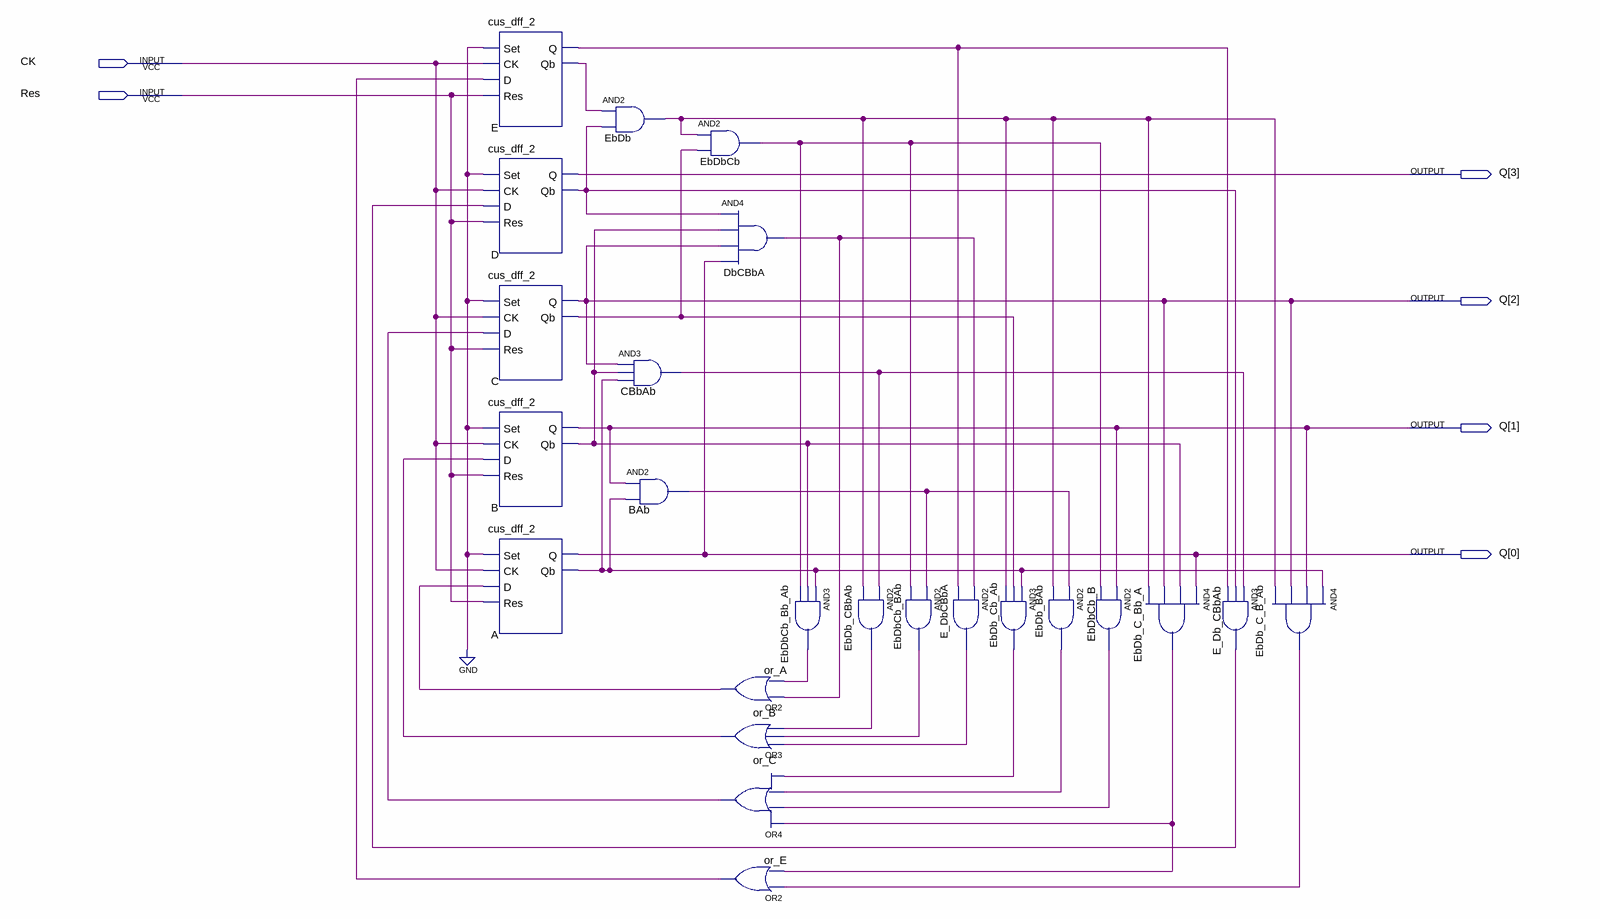
[diagram p0: schematic sheet]
// Quartus schematic number_count.bdf as structural Verilog: 24 symbols, 6 pins
module number_count (
  input  CK,
  input  Res,
  output [3:0] Q
);

  wire A_qb, B_qb, BAb_out, C_qb, CBbAb_out, D_qb, DbCBbA_out, E_Db_CBbAb_out, E_DbCBbA_out, E_q, E_qb,
       EbDb_BAb_out, EbDb_C_B_Ab_out, EbDb_C_Bb_A_out, EbDb_Cb_Ab_out, EbDb_CBbAb_out, EbDb_out,
       EbDbCb_B_out, EbDbCb_BAb_out, EbDbCb_Bb_Ab_out, EbDbCb_out, or_A_out, or_B_out, or_C_out, or_E_out;

  cus_dff_2 E (.Set(1'b0), .CK(CK), .D(or_E_out), .Res(Res), .Q(E_q), .Qb(E_qb));
  cus_dff_2 D (.Set(1'b0), .CK(CK), .D(E_Db_CBbAb_out), .Res(Res), .Q(Q[3]), .Qb(D_qb));
  cus_dff_2 C (.Set(1'b0), .CK(CK), .D(or_C_out), .Res(Res), .Q(Q[2]), .Qb(C_qb));
  cus_dff_2 B (.Set(1'b0), .CK(CK), .D(or_B_out), .Res(Res), .Q(Q[1]), .Qb(B_qb));
  cus_dff_2 A (.Set(1'b0), .CK(CK), .D(or_A_out), .Res(Res), .Q(Q[0]), .Qb(A_qb));
  and EbDb (EbDb_out, E_qb, D_qb);
  and CBbAb (CBbAb_out, Q[2], B_qb, A_qb);
  and BAb (BAb_out, Q[1], A_qb);
  and EbDbCb (EbDbCb_out, EbDb_out, C_qb);
  and DbCBbA (DbCBbA_out, D_qb, B_qb, Q[2], Q[0]);
  or or_A (or_A_out, DbCBbA_out, EbDbCb_Bb_Ab_out);
  or or_B (or_B_out, E_DbCBbA_out, EbDbCb_BAb_out, EbDb_CBbAb_out);
  or or_C (or_C_out, EbDb_C_Bb_A_out, EbDbCb_B_out, EbDb_BAb_out, EbDb_Cb_Ab_out);
  or or_E (or_E_out, EbDb_C_B_Ab_out, EbDb_C_Bb_A_out);
  and EbDbCb_Bb_Ab (EbDbCb_Bb_Ab_out, A_qb, B_qb, EbDbCb_out);
  and EbDb_CBbAb (EbDb_CBbAb_out, CBbAb_out, EbDb_out);
  and EbDbCb_BAb (EbDbCb_BAb_out, BAb_out, EbDbCb_out);
  and E_DbCBbA (E_DbCBbA_out, DbCBbA_out, E_q);
  and EbDb_Cb_Ab (EbDb_Cb_Ab_out, A_qb, C_qb, EbDb_out);
  and EbDb_BAb (EbDb_BAb_out, BAb_out, EbDb_out);
  and EbDbCb_B (EbDbCb_B_out, Q[1], EbDbCb_out);
  and EbDb_C_Bb_A (EbDb_C_Bb_A_out, Q[0], B_qb, Q[2], EbDb_out);
  and E_Db_CBbAb (E_Db_CBbAb_out, CBbAb_out, D_qb, E_q);
  and EbDb_C_B_Ab (EbDb_C_B_Ab_out, A_qb, Q[1], Q[2], EbDb_out);
endmodule
